# EAGLE design sensor_a2 (EAGLE 9.3.1)
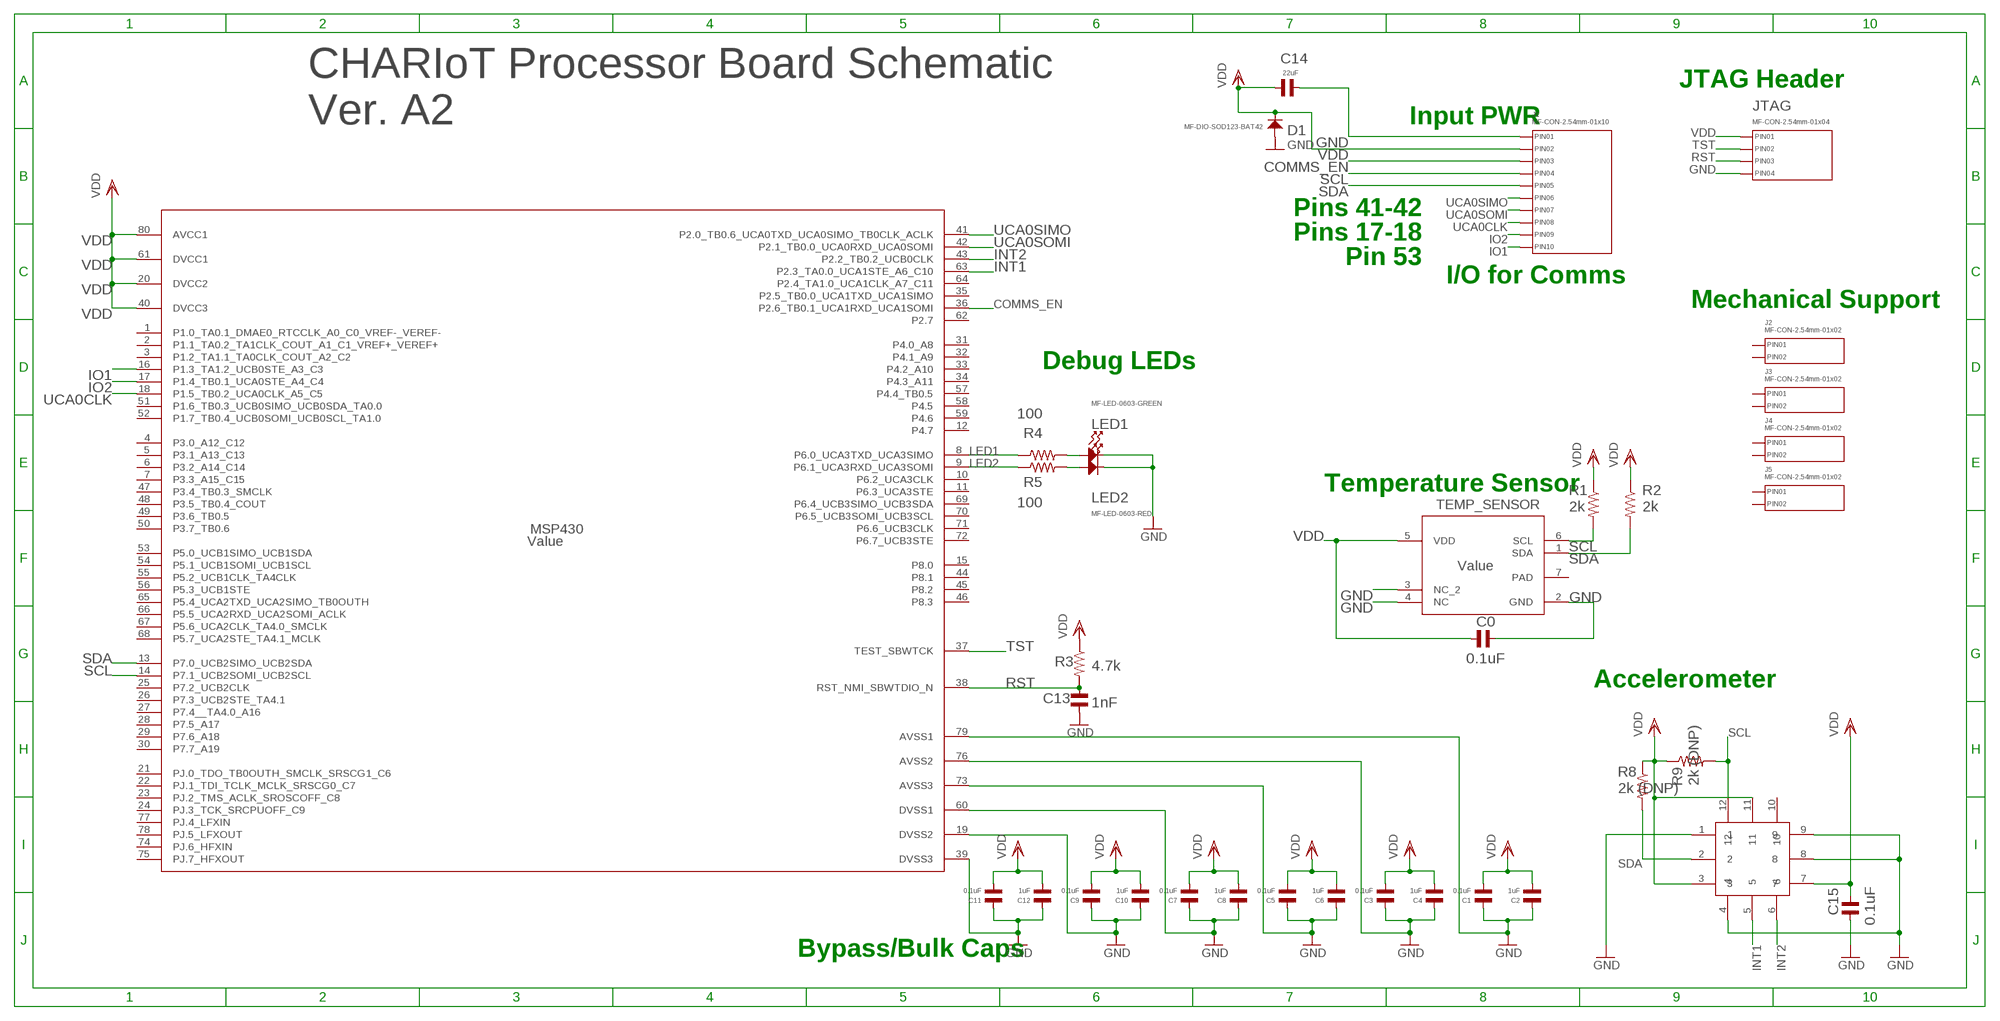
[diagram p0: schematic, sheet 1]

## Parts
ACCEL  BMA253  [LGA-12]
C0  0.1uF  CAPACITOR_NP_0603  [C0603]
C1  0.1uF  CAPACITOR_NP_0603  [C0603]
C2  1uF  CAPACITOR_NP_0603  [C0603]
C3  0.1uF  CAPACITOR_NP_0603  [C0603]
C4  1uF  CAPACITOR_NP_0603  [C0603]
C5  0.1uF  CAPACITOR_NP_0603  [C0603]
C6  1uF  CAPACITOR_NP_0603  [C0603]
C7  0.1uF  CAPACITOR_NP_0603  [C0603]
C8  1uF  CAPACITOR_NP_0603  [C0603]
C9  0.1uF  CAPACITOR_NP_0603  [C0603]
C10  1uF  CAPACITOR_NP_0603  [C0603]
C11  0.1uF  CAPACITOR_NP_0603  [C0603]
C12  1uF  CAPACITOR_NP_0603  [C0603]
C13  1nF  CAPACITOR_NP_0603  [C0603]
C14  22uF  CAPACITOR_NP_0603  [C0603]
C15  0.1uF  CAPACITOR_NP_0603  [C0603]
D1  MF-DIO-SOD123-BAT42  DIODES_BAT42_SOD-123  [SOD-123]
J1  MF-CON-2.54mm-01x10  CON_01X10_PTH_2.54MM  [PTH_2.54MM_01X10]
J2  MF-CON-2.54mm-01x02  CON_01X02_PTH_2.54MM  [PTH_2.54MM_01X02]
J3  MF-CON-2.54mm-01x02  CON_01X02_PTH_2.54MM  [PTH_2.54MM_01X02]
J4  MF-CON-2.54mm-01x02  CON_01X02_PTH_2.54MM  [PTH_2.54MM_01X02]
J5  MF-CON-2.54mm-01x02  CON_01X02_PTH_2.54MM  [PTH_2.54MM_01X02]
JTAG  MF-CON-2.54mm-01x04  CON_01X04_PTH_2.54MM  [PTH_2.54MM_01X04]
LED1  MF-LED-0603-GREEN  LED_SINGLE-0603-GREEN  [LED0603]
LED2  MF-LED-0603-RED  LED_SINGLE-0603-RED  [LED0603]
MSP430  Value  MSP430FR5994IPNR  [PN0080A_N]
R1  2k  RESISTOR_0603  [R0603]
R2  2k  RESISTOR_0603  [R0603]
R3  4.7k  RESISTOR_0603  [R0603]
R4  100  RESISTOR_0603  [R0603]
R5  100  RESISTOR_0603  [R0603]
R8  2k (DNP)  RESISTOR_0603  [R0603]
R9  2k (DNP)  RESISTOR_0603  [R0603]
TEMP_SENSOR  Value  HDC1080DMBR  [DMB0006A]

## Nets
COMMS_EN: J1.P$3(PIN3) MSP430.36(P2.6_TB0.1_UCA1RXD_UCA1SOMI)
GND: ACCEL.1 ACCEL.4 ACCEL.8 ACCEL.9 C0.P$2 C1.P$1 C2.P$1 C3.P$1 C4.P$1 C5.P$1 C6.P$1 C7.P$1 C8.P$1 C9.P$1 C10.P$1 C11.P$1 C12.P$1 C13.P$2 C14.P$2 C15.P$1 D1.ANODE J1.P$1(PIN1) JTAG.P$4(PIN4) LED1.CATHODE LED2.CATHODE MSP430.19(DVSS2) MSP430.39(DVSS3) MSP430.60(DVSS1) MSP430.73(AVSS3) MSP430.76(AVSS2) MSP430.79(AVSS1) TEMP_SENSOR.2(GND) TEMP_SENSOR.3(NC_2) TEMP_SENSOR.4(NC)
INT1: ACCEL.5 MSP430.63(P2.3_TA0.0_UCA1STE_A6_C10)
INT2: ACCEL.6 MSP430.43(P2.2_TB0.2_UCB0CLK)
IO1: J1.P$10(PIN10) MSP430.16(P1.3_TA1.2_UCB0STE_A3_C3)
IO2: J1.P$9(PIN9) MSP430.17(P1.4_TB0.1_UCA0STE_A4_C4)
LED1: MSP430.8(P6.0_UCA3TXD_UCA3SIMO) R4.P$1
LED2: MSP430.9(P6.1_UCA3RXD_UCA3SOMI) R5.P$1
N$1: LED1.ANODE R4.P$2
N$2: LED2.ANODE R5.P$2
RST: C13.P$1 JTAG.P$3(PIN3) MSP430.38(RST_NMI_SBWTDIO_N) R3.P$2
SCL: ACCEL.12 J1.P$4(PIN4) MSP430.14(P7.1_UCB2SOMI_UCB2SCL) R1.P$2 R9.P$2 TEMP_SENSOR.6(SCL)
SDA: ACCEL.2 J1.P$5(PIN5) MSP430.13(P7.0_UCB2SIMO_UCB2SDA) R2.P$2 R8.P$2 TEMP_SENSOR.1(SDA)
TST: JTAG.P$2(PIN2) MSP430.37(TEST_SBWTCK)
UCA0CLK: J1.P$8(PIN8) MSP430.18(P1.5_TB0.2_UCA0CLK_A5_C5)
UCA0SIMO: J1.P$6(PIN6) MSP430.41(P2.0_TB0.6_UCA0TXD_UCA0SIMO_TB0CLK_ACLK)
UCA0SOMI: J1.P$7(PIN7) MSP430.42(P2.1_TB0.0_UCA0RXD_UCA0SOMI)
VDD: ACCEL.3 ACCEL.7 ACCEL.11 C0.P$1 C1.P$2 C2.P$2 C3.P$2 C4.P$2 C5.P$2 C6.P$2 C7.P$2 C8.P$2 C9.P$2 C10.P$2 C11.P$2 C12.P$2 C14.P$1 C15.P$2 D1.CATHODE J1.P$2(PIN2) JTAG.P$1(PIN1) MSP430.20(DVCC2) MSP430.40(DVCC3) MSP430.61(DVCC1) MSP430.80(AVCC1) R1.P$1 R2.P$1 R3.P$1 R8.P$1 R9.P$1 TEMP_SENSOR.5(VDD)
Unconnected: ACCEL.10 J2.P$1(PIN1) J2.P$2(PIN2) J3.P$1(PIN1) J3.P$2(PIN2) J4.P$1(PIN1) J4.P$2(PIN2) J5.P$1(PIN1) J5.P$2(PIN2) MSP430.1(P1.0_TA0.1_DMAE0_RTCCLK_A0_C0_VREF-_VEREF-) MSP430.2(P1.1_TA0.2_TA1CLK_COUT_A1_C1_VREF+_VEREF+) MSP430.3(P1.2_TA1.1_TA0CLK_COUT_A2_C2) MSP430.4(P3.0_A12_C12) MSP430.5(P3.1_A13_C13) MSP430.6(P3.2_A14_C14) MSP430.7(P3.3_A15_C15) MSP430.10(P6.2_UCA3CLK) MSP430.11(P6.3_UCA3STE) MSP430.12(P4.7) MSP430.15(P8.0) MSP430.21(PJ.0_TDO_TB0OUTH_SMCLK_SRSCG1_C6) MSP430.22(PJ.1_TDI_TCLK_MCLK_SRSCG0_C7) MSP430.23(PJ.2_TMS_ACLK_SROSCOFF_C8) MSP430.24(PJ.3_TCK_SRCPUOFF_C9) MSP430.25(P7.2_UCB2CLK) MSP430.26(P7.3_UCB2STE_TA4.1) MSP430.27(P7.4__TA4.0_A16) MSP430.28(P7.5_A17) MSP430.29(P7.6_A18) MSP430.30(P7.7_A19) MSP430.31(P4.0_A8) MSP430.32(P4.1_A9) MSP430.33(P4.2_A10) MSP430.34(P4.3_A11) MSP430.35(P2.5_TB0.0_UCA1TXD_UCA1SIMO) MSP430.44(P8.1) MSP430.45(P8.2) MSP430.46(P8.3) MSP430.47(P3.4_TB0.3_SMCLK) MSP430.48(P3.5_TB0.4_COUT) MSP430.49(P3.6_TB0.5) MSP430.50(P3.7_TB0.6) MSP430.51(P1.6_TB0.3_UCB0SIMO_UCB0SDA_TA0.0) MSP430.52(P1.7_TB0.4_UCB0SOMI_UCB0SCL_TA1.0) MSP430.53(P5.0_UCB1SIMO_UCB1SDA) MSP430.54(P5.1_UCB1SOMI_UCB1SCL) MSP430.55(P5.2_UCB1CLK_TA4CLK) MSP430.56(P5.3_UCB1STE) MSP430.57(P4.4_TB0.5) MSP430.58(P4.5) MSP430.59(P4.6) MSP430.62(P2.7) MSP430.64(P2.4_TA1.0_UCA1CLK_A7_C11) MSP430.65(P5.4_UCA2TXD_UCA2SIMO_TB0OUTH) MSP430.66(P5.5_UCA2RXD_UCA2SOMI_ACLK) MSP430.67(P5.6_UCA2CLK_TA4.0_SMCLK) MSP430.68(P5.7_UCA2STE_TA4.1_MCLK) MSP430.69(P6.4_UCB3SIMO_UCB3SDA) MSP430.70(P6.5_UCB3SOMI_UCB3SCL) MSP430.71(P6.6_UCB3CLK) MSP430.72(P6.7_UCB3STE) MSP430.74(PJ.6_HFXIN) MSP430.75(PJ.7_HFXOUT) MSP430.77(PJ.4_LFXIN) MSP430.78(PJ.5_LFXOUT)

## Notes on the sheet
- JTAG Header
- CHARIoT Processor Board Schematic 
  Ver. A2
- Input PWR
- Pins 41-42
- Pins 17-18
- Pin 53
- I/O for Comms
- Mechanical Support
- Debug LEDs
- Temperature Sensor
- Accelerometer
- Bypass/Bulk Caps

## Power pins joined to a net without a drawn wire
PAD: TEMP_SENSOR.7(PAD)

## Library data of the parts
ACCEL = CharIoT:BMA253
C0 C1-C15 = MF_Passives:CAPACITOR_NP: Library: MF_Passives Description: Device for Non-Polarized Capacitors. Manufacture part number (MPN) can be added via Attributes. Check https://factory.macrofab.com/parts for the house parts list.; POPULATE: 1
D1 = MF_Discrete_Semiconductor:DIODES: Library: MF_Discrete_Semiconductor Description: Device for Single Packaged Diodes.; HOUSEPART: YES; MPN: MF-DIO-SOD123-BAT42; POPULATE: 1; URL: https://factory.macrofab.com/part/MF-DIO-SOD123-BAT42
J1 = MF_Connectors:CON_01X10: Library: MF_Connectors Description: Header Connector with 10 Positions and 01 Rows. Use the LABEL Attribute to label the pin on the schematic and PCB. You can remove the attributes on the PCB by using the SMASH function on the part and then deleting the text.; HOUSEPART: YES; MPN: MF-CON-2.54mm-01x10; POPULATE: 1; URL: https://factory.macrofab.com/part/MF-CON-2.54mm-01x10
J2-J5 = MF_Connectors:CON_01X02: Library: MF_Connectors Description: Header Connector with 02 Positions and 01 Rows. Use the LABEL Attribute to label the pin on the schematic and PCB. You can remove the attributes on the PCB by using the SMASH function on the part and then deleting the text.; HOUSEPART: YES; MPN: MF-CON-2.54mm-01x02; POPULATE: 1; URL: https://factory.macrofab.com/part/MF-CON-2.54mm-01x02
JTAG = MF_Connectors:CON_01X04: Library: MF_Connectors Description: Header Connector with 04 Positions and 01 Rows. Use the LABEL Attribute to label the pin on the schematic and PCB. You can remove the attributes on the PCB by using the SMASH function on the part and then deleting the text.; HOUSEPART: YES; MPN: MF-CON-2.54mm-01x04; POPULATE: 1; URL: https://factory.macrofab.com/part/MF-CON-2.54mm-01x04
LED1 = MF_LEDs:LED_SINGLE: Library: MF_LEDs Description: Device for Single LED Packages. Manufacture part number (MFG#) can be added via Attributes.; HOUSEPART: YES; MPN: MF-LED-0603-GREEN; POPULATE: 1; URL: https://factory.macrofab.com/part/MF-LED-0603-GREEN
LED2 = MF_LEDs:LED_SINGLE: Library: MF_LEDs Description: Device for Single LED Packages. Manufacture part number (MFG#) can be added via Attributes.; HOUSEPART: YES; MPN: MF-LED-0603-RED; POPULATE: 1; URL: https://factory.macrofab.com/part/MF-LED-0603-RED
MSP430 = CharIoT:MSP430FR5994IPNR: Processor; MANUFACTURER: Texas Instruments; PARTNUMBER: MSP430FR5994IPNR; REFDES: RefDes; TYPE: TYPE
R1-R5 R8 R9 = MF_Passives:RESISTOR: Library: MF_Passives Description: Device for Resistors. Manufacture part number (MPN), Voltage, Tolerance, and Wattage Rating can be added via Attributes. Check https://factory.macrofab.com/parts for the house parts list.; POPULATE: 1
TEMP_SENSOR = CharIoT:HDC1080DMBR: Temp Sensor; ALTERNATEPARTNUMBER: HDC1080DMBT; APPLICATION_BUILDNUMBER: *; COMPTYPE: IC; MANUFACTURER: Texas Instruments; MOUNTTYPE: SMT; PACKAGEREFERENCE: DMB0006A; PARTNUMBER: HDC1080DMBR; PIN_COUNT: 7; REFDES: RefDes; TYPE: TYPE

## Board
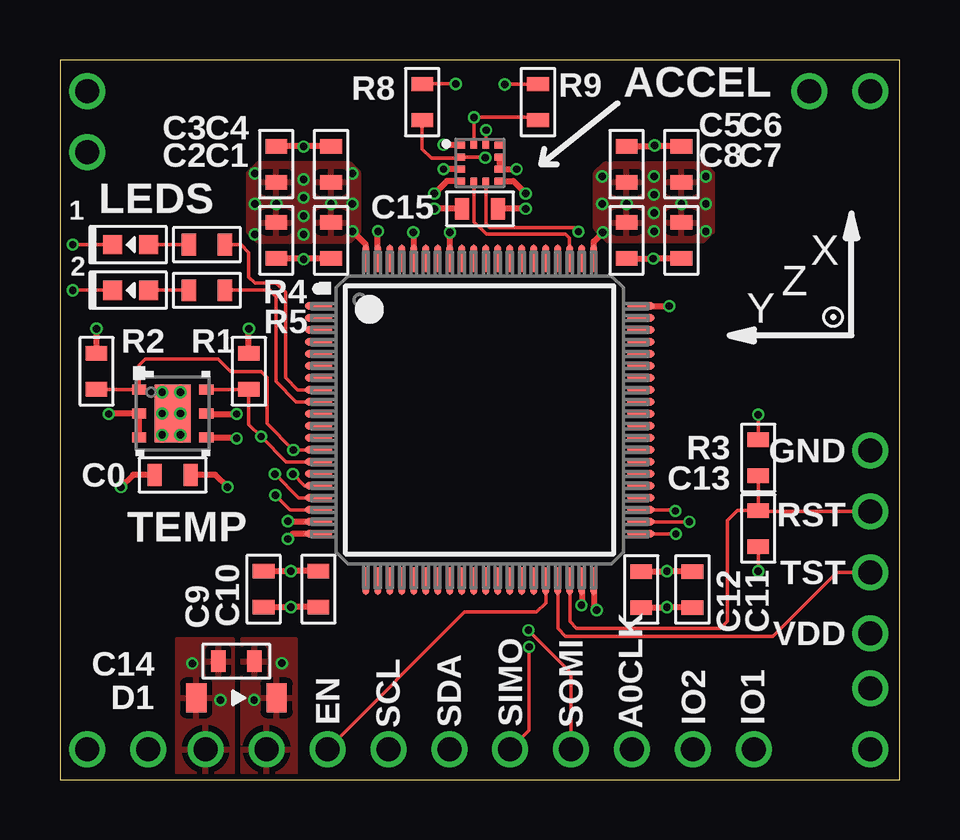
[diagram p1: board, top side]
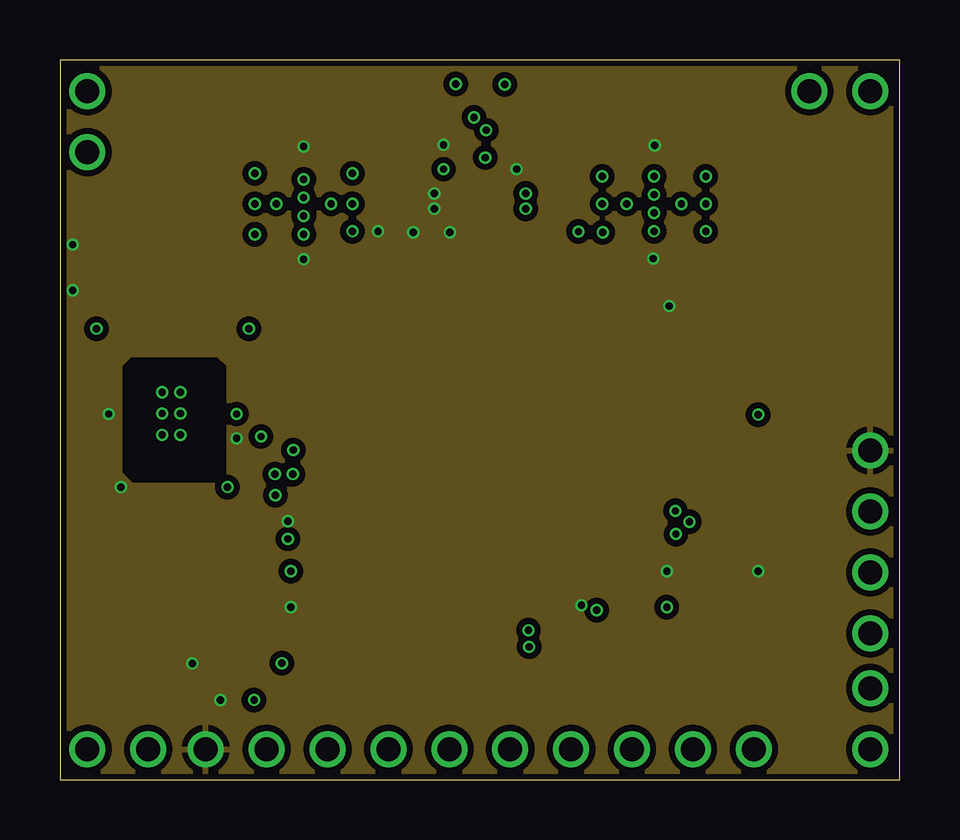
[diagram p2: board, inner layer Route2]
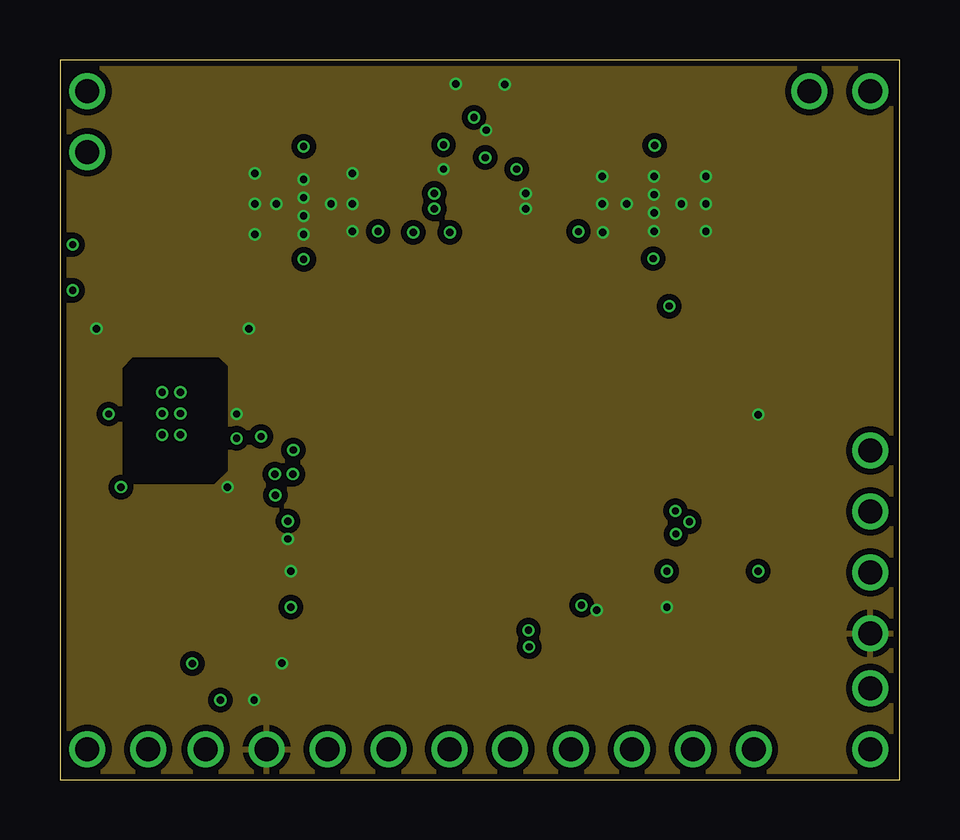
[diagram p3: board, inner layer Route15]
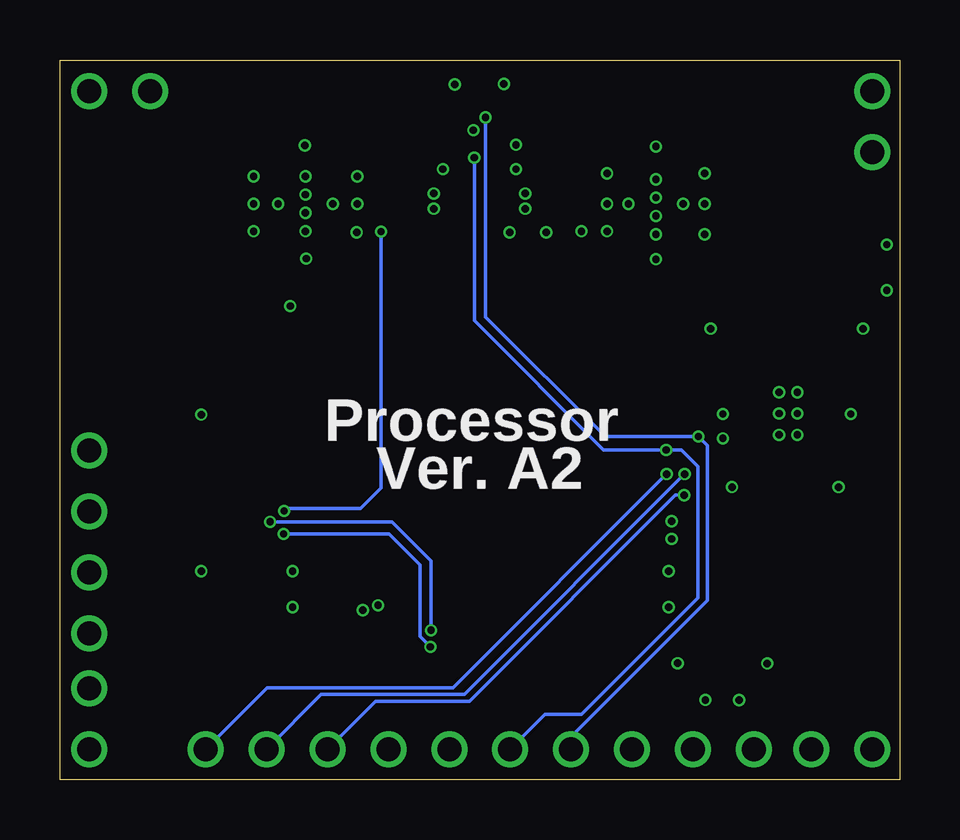
[diagram p4: board, bottom side, seen from below]

Size 35 x 30 mm. Coordinates in mm from the lower left corner, seen from the top.
Outline: 0,0 35,0 35,30 0,30 0,0
Copper layers (1*2*15*16): Top 0.035mm / dielectric 0.23mm / Route2 0.035mm / dielectric 0.93mm / Route15 0.035mm / dielectric 0.23mm / Bottom 0.035mm
Design rules "MF_Standard_4_Layer *": minimum track width 5mil, minimum drill 10mil, track to track 5mil, track to pad 5mil, pad to pad 5mil, via to via 5mil, smd to smd 0mil, copper to edge 10mil, drill to drill 10mil, minimum pad ring 4mil, minimum via ring 4mil, stop-mask expansion 2mil, vias tented up to drill 25mil, thermal gap 10mil

### Footprints (pad centres in the part's own frame; a part is rotated, then mirrored left to right if it is on the bottom)
LGA-12 = smd 0.41 x 0.28: 1 -0.815,0.75; 2 -0.815,0.25; 3 -0.815,-0.25; 4 -0.815,-0.75; 7 0.815,-0.75; 8 0.815,-0.25; 9 0.815,0.25; 10 0.815,0.75 | smd 0.28 x 0.41: 5 -0.25,-0.815; 6 0.25,-0.815; 11 0.25,0.815; 12 -0.25,0.815
C0603 = smd 0.6 x 0.9: P$1 -0.75,0; P$2 0.75,0
SOD-123 = smd 0.85 x 1.2: ANODE 1.675,0; CATHODE -1.675,0
PTH_2.54MM_01X10 = drill 1: P$1 -11.43,0; P$2 -8.89,0; P$3 -6.35,0; P$4 -3.81,0; P$5 -1.27,0; P$6 1.27,0; P$7 3.81,0; P$8 6.35,0; P$9 8.89,0; P$10 11.43,0
PTH_2.54MM_01X02 = drill 1: P$1 -1.27,0; P$2 1.27,0
PTH_2.54MM_01X04 = drill 1: P$1 -3.81,0; P$2 -1.27,0; P$3 1.27,0; P$4 3.81,0
LED0603 = smd 0.8 x 0.8: ANODE 0.75,0; CATHODE -0.75,0
PN0080A_N = smd 1.15 x 0.3: 1 -6.725,4.75; 2 -6.725,4.25; 3 -6.725,3.75; 4 -6.725,3.25; 5 -6.725,2.75; 6 -6.725,2.25; 7 -6.725,1.75; 8 -6.725,1.25; 9 -6.725,0.75; 10 -6.725,0.25; 11 -6.725,-0.25; 12 -6.725,-0.75; 13 -6.725,-1.25; 14 -6.725,-1.75; 15 -6.725,-2.25; 16 -6.725,-2.75; 17 -6.725,-3.25; 18 -6.725,-3.75; 19 -6.725,-4.25; 20 -6.725,-4.75; 41 6.725,-4.75; 42 6.725,-4.25; 43 6.725,-3.75; 44 6.725,-3.25; 45 6.725,-2.75; 46 6.725,-2.25; 47 6.725,-1.75; 48 6.725,-1.25; 49 6.725,-0.75; 50 6.725,-0.25; 51 6.725,0.25; 52 6.725,0.75; 53 6.725,1.25; 54 6.725,1.75; 55 6.725,2.25; 56 6.725,2.75; 57 6.725,3.25; 58 6.725,3.75; 59 6.725,4.25; 60 6.725,4.75 | smd 0.3 x 1.15: 21 -4.75,-6.725; 22 -4.25,-6.725; 23 -3.75,-6.725; 24 -3.25,-6.725; 25 -2.75,-6.725; 26 -2.25,-6.725; 27 -1.75,-6.725; 28 -1.25,-6.725; 29 -0.75,-6.725; 30 -0.25,-6.725; 31 0.25,-6.725; 32 0.75,-6.725; 33 1.25,-6.725; 34 1.75,-6.725; 35 2.25,-6.725; 36 2.75,-6.725; 37 3.25,-6.725; 38 3.75,-6.725; 39 4.25,-6.725; 40 4.75,-6.725; 61 4.75,6.725; 62 4.25,6.725; 63 3.75,6.725; 64 3.25,6.725; 65 2.75,6.725; 66 2.25,6.725; 67 1.75,6.725; 68 1.25,6.725; 69 0.75,6.725; 70 0.25,6.725; 71 -0.25,6.725; 72 -0.75,6.725; 73 -1.25,6.725; 74 -1.75,6.725; 75 -2.25,6.725; 76 -2.75,6.725; 77 -3.25,6.725; 78 -3.75,6.725; 79 -4.25,6.725; 80 -4.75,6.725
R0603 = smd 0.6 x 0.9: P$1 -0.75,0; P$2 0.75,0
DMB0006A = smd 0.6 x 0.4: 1 -1.4,1; 2 -1.4,0; 3 -1.4,-1; 4 1.4,-1; 5 1.4,0; 6 1.4,1 | smd 1.5 x 2.4: 7 0,0

### Placement (x,y rotation side)
ACCEL  17.5,25.7 0 top
C0  4.7,12.7 180 top
C1  11.3,22.48 90 top
C2  9.02,22.48 90 top
C3  9.02,25.65 270 top
C4  11.3,25.65 270 top
C5  23.62,25.65 270 top
C6  25.91,25.65 270 top
C7  25.91,22.48 90 top
C8  23.62,22.48 90 top
C9  8.49,7.94 90 top
C10  10.78,7.94 90 top
C11  26.37,7.92 270 top
C12  24.23,7.92 270 top
C13  29.11,10.46 270 top
C14  7.35,4.93 180 top
C15  17.51,23.8 0 top
D1  7.35,3.41 180 top
J1  17.5,1.27 0 top
J2  33.78,2.54 90 top
J3  2.41,1.27 0 top
J4  1.14,27.43 90 top
J5  32.51,28.7 0 top
JTAG  33.78,9.91 90 top
LED1  2.95,22.3 0 top
LED2  2.95,20.4 0 top
MSP430  17.5,15 0 top
R1  7.87,17.02 270 top
R2  1.52,17.02 270 top
R3  29.11,13.41 270 top
R4  6.12,22.3 180 top
R5  6.12,20.4 180 top
R8  15.1,28.24 270 top
R9  19.93,28.24 270 top
TEMP_SENSOR  4.7,15.26 0 top
U$1  [XYZ-LABEL]  32.99,18.52 90 top

### Tracks (layer width: path | path; a pad name or v marks a point on that pad's centre or on a via)
COMMS_EN
  Top 0.152: MSP430.36 20.25,7.37 19.86,6.98 16.86,6.98 J1.P$3
GND  (via drill 0.3)
  Top 0.152: C13.P$2 v29.11,8.69 | LED2.CATHODE v0.53,20.4 | LED1.CATHODE v0.53,22.3 | C8.P$1 | 24.74,21.73 v24.73,21.72
  Top 0.254: v2.03,15.24 2.05,15.26 TEMP_SENSOR.2 TEMP_SENSOR.3 | TEMP_SENSOR.4 7.33,14.26 v7.37,14.22 | C0.P$2 3.05,12.7 v2.54,12.19 | ACCEL.1 v16,26.45 v15.99,26.46 | v19.04,25.45 v19.03,25.45 ACCEL.8 ACCEL.9 | ACCEL.4 16.13,24.95 v15.61,24.43 | C15.P$1 v15.61,23.8 | C8.P$1 v24.73,21.72 | C2.P$1 C1.P$1 10.2,21.73 v10.16,21.69 | v10.16,26.39 10.17,26.4 C4.P$1 C3.P$1 | C6.P$1 24.83,26.4 v24.79,26.44 24.75,26.4 C5.P$1 | C7.P$1 24.74,21.73 | C11.P$1 25.31,8.68 | 25.31,8.68 v25.3,8.69 | C12.P$1 25.31,8.68 | MSP430.39 21.75,7.27 v21.74,7.26 | MSP430.60 25.39,19.75 v25.4,19.74 | MSP430.79 v13.25,22.85 v13.26,22.86 | MSP430.73 v16.25,22.8 v16.26,22.81 | MSP430.19 9.52,10.75 v9.5,10.77 | MSP430.76 14.75,22.79 v14.73,22.81 | C9.P$1 v9.62,7.19 | v9.62,7.19 v9.63,7.19 | C10.P$1 v9.62,7.19
  other vias: 6.68,3.31 5.52,4.84
  pour Route2 (isolate 0.254): 0.25,0.25 34.8,0.25 34.8,29.73 0.25,29.73
  cutout Route2: 2.67,17.21 2.67,12.83 3.05,12.45 6.48,12.45 6.86,12.83 6.86,17.21 6.54,17.53 2.98,17.53
  pour Top: 7.21,0.29 7.21,5.86 4.86,5.86 4.86,0.29
INT1
  Top 0.152: MSP430.63 21.23,21.74 21.23,22.58 21.08,22.73 17.78,22.73 17.27,23.25 17.27,24.33 17.25,24.34 ACCEL.5
INT2  (via drill 0.3)
  Top 0.152: ACCEL.6 17.75,23.17 17.91,23.01 21.45,23.01 v21.61,22.85 | v25.65,11.2 25.61,11.25 MSP430.43
  Bottom 0.152: v21.61,22.85 21.61,12.17 22.48,11.3 25.55,11.3 v25.65,11.2
IO1  (via drill 0.3)
  Top 0.152: MSP430.16 10.19,12.25 v9.71,12.73
  Bottom 0.152: J1.P$10 26.37,3.83 18.62,3.83 v9.71,12.73
IO2  (via drill 0.3)
  Top 0.152: MSP430.17 9.94,11.75 v8.96,12.73
  Bottom 0.152: v8.96,12.73 18.14,3.55 24.11,3.55 J1.P$9
LED1
  Top 0.152: MSP430.8 9.91,16.25 9.4,16.76 9.4,20.32 9.02,20.7 8.13,20.7 7.87,20.95 7.87,21.97 7.54,22.3 R4.P$1
LED2
  Top 0.152: MSP430.9 9.85,15.75 9.02,16.59 9.02,20.14 8.76,20.4 R5.P$1
N$1
  Top 0.152: R4.P$2 LED1.ANODE
N$2
  Top 0.152: R5.P$2 LED2.ANODE
N$9  (via drill 0.3)
  other vias: 4.26,14.37
N$10  (via drill 0.3)
  other vias: 5.02,14.37
N$11  (via drill 0.3)
  other vias: 5.02,15.26
N$12  (via drill 0.3)
  other vias: 5.02,16.15
N$13  (via drill 0.3)
  other vias: 4.26,16.15
N$14  (via drill 0.3)
  other vias: 4.26,15.26
RST
  Top 0.152: C13.P$1 R3.P$2 | JTAG.P$3 29.15,11.18 C13.P$1 | MSP430.38 21.25,6.59 21.54,6.3 27.51,6.3 27.81,6.6 27.81,10.79 28.23,11.21 C13.P$1
SCL  (via drill 0.3)
  Top 0.152: TEMP_SENSOR.6 R1.P$2 7.87,14.81 v8.38,14.3 9.43,13.25 MSP430.14 | ACCEL.12 v17.26,27.61 v17.27,27.62 19.8,27.62 R9.P$2
  Bottom 0.152: J1.P$4 13.69,1.78 8,7.47 8,13.92 v8.38,14.3 12.27,14.3 17.26,19.29 v17.26,27.61
SDA  (via drill 0.3)
  Top 0.152: MSP430.13 10.77,13.74 v9.73,13.74 8.64,14.83 8.64,16.76 8.38,17.02 7.11,17.02 6.6,17.53 3.56,17.53 3.3,17.27 TEMP_SENSOR.1 1.53,16.26 R2.P$2 | v17.73,25.93 17.71,25.95 ACCEL.2 16.64,25.9 15.48,25.9 15.1,26.29 R8.P$2
  Bottom 0.152: J1.P$5 14.77,2.73 13.25,2.73 8.41,7.57 8.41,13.06 9.09,13.74 v9.73,13.74 12.34,13.74 17.73,19.13 v17.73,25.93
TST
  Top 0.152: JTAG.P$2 32.38,8.64 29.72,5.97 21.08,5.97 20.75,6.3 MSP430.37
UCA0CLK  (via drill 0.3)
  Top 0.152: MSP430.18 9.58,11.25 v8.98,11.86
  Bottom 0.152: v8.98,11.86 9.34,11.86 17.93,3.27 21.85,3.27 J1.P$8
UCA0SIMO  (via drill 0.3)
  Top 0.152: v25.68,10.24 24.24,10.24 MSP430.41 | v19.56,5.53 19.56,2.06 J1.P$6
  Bottom 0.152: v25.68,10.24 21.29,10.24 19.99,8.94 19.99,5.96 v19.56,5.53
UCA0SOMI  (via drill 0.3)
  Top 0.152: v26.24,10.74 MSP430.42 | v19.53,6.22 21.31,4.45 J1.P$7
  Bottom 0.152: v19.53,6.22 19.53,9.12 21.16,10.74 v26.24,10.74
VDD  (via drill 0.3)
  Top 0.152: TEMP_SENSOR.5 6.12,15.24 | R3.P$1 v29.11,15.21 | v16.5,29 15.11,29 R8.P$1 | R9.P$1 19.92,28.98 v18.54,28.98 | ACCEL.11 17.77,26.53 v17.77,27.07
  Top 0.254: R2.P$1 v1.52,18.8 | R1.P$1 v7.87,18.8 | 6.12,15.24 v7.37,15.24 | v6.99,12.19 6.48,12.7 C0.P$1 | MSP430.80 12.75,22.3 v12.19,22.86 | MSP430.61 22.25,22.43 v22.63,22.81 | MSP430.40 22.25,7.19 v22.38,7.06 | MSP430.20 9.72,10.25 v9.5,10.03 | ACCEL.3 v15.99,25.45 | v19.42,24.43 18.9,24.95 ACCEL.7 | v19.42,23.8 C15.P$2 | C11.P$2 25.31,7.17 v25.3,7.19 25.29,7.17 C12.P$2 | C10.P$2 v9.63,8.69 v9.62,8.69 C9.P$2
  other vias: 9.25,4.85 8.09,3.32 10.16,25.02 24.77,25.15 24.77,23.62 24.77,24.38 24.77,22.86 25.91,24 23.62,24 10.16,24.26 10.16,23.5 10.16,22.73 11.3,24 9.02,24 8.13,24 12.19,24 12.19,25.27 8.13,25.27 8.13,22.73 22.61,24 22.61,25.15 26.92,25.15 26.92,24 26.92,22.86
  pour Route15 (isolate 0.254): 0.25,29.72 0.25,0.25 34.8,0.25 34.8,29.72
  cutout Route15: 3.05,17.53 2.67,17.14 2.67,12.83 3.11,12.38 6.41,12.38 6.92,12.89 6.92,17.21 6.6,17.53
  pour Top: 8.03,0.26 9.85,0.26 9.85,5.86 7.59,5.86 7.59,0.28
  pour Top: 24.77,25.65 26.8,25.65 27.18,25.27 27.18,22.86 26.8,22.48 22.99,22.48 22.86,22.48 22.35,22.99 22.35,25.27 22.73,25.65
  pour Top: 10.16,25.65 8.26,25.65 7.87,25.27 7.87,22.86 8.26,22.48 12.06,22.48 12.45,22.86 12.45,25.27 12.06,25.65

### Text on the board
tNames: LEDS | 1 | 2 | R4 | R5 | . | . | GND | RST | TEMP | TST | VDD | EN | SCL | SDA | SIMO | SOMI | A0CLK | IO2 | IO1
bNames: Processor | Ver. A2